# EAGLE schematic receiver (EAGLE 5.09)
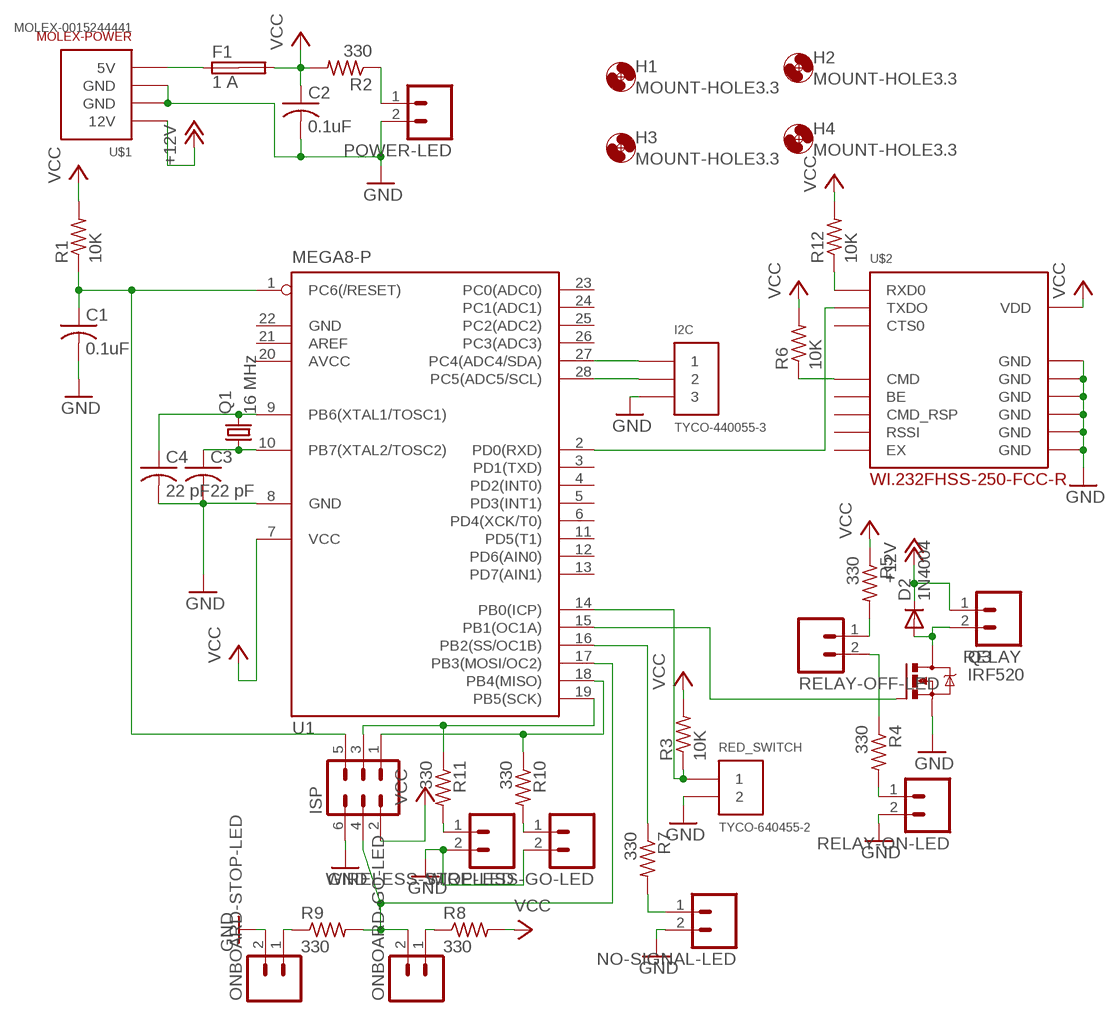
[diagram p0: schematic, sheet 1]

## Parts
C1  0.1uF  C-USC1206  [C1206]
C2  0.1uF  C-USC1206  [C1206]
C3  22 pF  C-USC1206  [C1206]
C4  22 pF  C-USC1206  [C1206]
D2  1N4004  [DO41-10]
F1  1 A  SHK20Q  [SHK20Q]
H1  MOUNT-HOLE3.3  [3,3]
H2  MOUNT-HOLE3.3  [3,3]
H3  MOUNT-HOLE3.3  [3,3]
H4  MOUNT-HOLE3.3  [3,3]
I2C  TYCO-440055-3  [HEADER-RA-2.00MM-3]
ISP  MA03-2  [MA03-2]
NO-SIGNAL-LED  M02POLAR  [MOLEX-1X2]
ONBOARD-GO-LED  M02POLAR  [MOLEX-1X2]
ONBOARD-STOP-LED  M02POLAR  [MOLEX-1X2]
POWER-LED  M02POLAR  [MOLEX-1X2]
Q1  16 MHz  CRYSTALHC49S  [HC49/S]
Q3  IRF520  [TO220BV]
R1  10K  R-US_R1206  [R1206]
R2  330  R-US_R1206  [R1206]
R3  10K  R-US_R1206  [R1206]
R4  330  R-US_R1206  [R1206]
R5  330  R-US_R1206  [R1206]
R6  10K  R-US_R1206  [R1206]
R7  330  R-US_R1206  [R1206]
R8  330  R-US_R1206  [R1206]
R9  330  R-US_R1206  [R1206]
R10  330  R-US_R1206  [R1206]
R11  330  R-US_R1206  [R1206]
R12  10K  R-US_R1206  [R1206]
RED_SWITCH  TYCO-640455-2  [HEADER-RA-POL-.100IN-2]
RELAY  M02POLAR  [MOLEX-1X2]
RELAY-OFF-LED  M02POLAR  [MOLEX-1X2]
RELAY-ON-LED  M02POLAR  [MOLEX-1X2]
U1  MEGA8-P  [DIL28-3]
U$1  MOLEX-0015244441  [MOLEX-0015244441B]
U$2  WI.232FHSS-250-FCC-R  [RADIOTRONIX-EVM]
WIRELESS-GO-LED  M02POLAR  [MOLEX-1X2]
WIRELESS-STOP-LED  M02POLAR  [MOLEX-1X2]

## Nets
+12V: D2.C RELAY.1 U$1.1(12V)
GND: C1.2 C2.2 C3.2 C4.2 I2C.3 ISP.6 NO-SIGNAL-LED.2 ONBOARD-STOP-LED.2 POWER-LED.2 Q3.S RED_SWITCH.2 RELAY-ON-LED.2 U1.8(GND) U$1.2(GND) U$1.3(GND) U$2.JP1-1(GND) U$2.JP1-2(GND) U$2.JP1-11(GND) U$2.JP1-12(GND) U$2.JP2-11(GND) U$2.JP2-12(GND) WIRELESS-GO-LED.2 WIRELESS-STOP-LED.2
N$1: D2.A Q3.D RELAY.2
N$2: C3.1 Q1.1 U1.10(PB7(XTAL2/TOSC2))
N$3: C1.1 ISP.5 R1.1 U1.1(PC6(/RESET))
N$4: C4.1 Q1.2 U1.9(PB6(XTAL1/TOSC1))
N$5: Q3.G U1.15(PB1(OC1A))
N$6: F1.1A U$1.4(5V)
N$7: R3.1 RED_SWITCH.1 U1.14(PB0(ICP))
N$8: R5.2 RELAY-OFF-LED.1
N$9: R4.1 RELAY-OFF-LED.2
N$10: R4.2 RELAY-ON-LED.1
N$11: NO-SIGNAL-LED.1 R7.2
N$12: R6.1 U$2.JP2-5(CMD)
N$13: I2C.1 U1.27(PC4(ADC4/SDA))
N$14: I2C.2 U1.28(PC5(ADC5/SCL))
N$15: U1.2(PD0(RXD)) U$2.JP2-3(TXDO)
N$16: R7.1 U1.16(PB2(SS/OC1B))
N$17: ONBOARD-STOP-LED.1 R9.1
N$18: ONBOARD-GO-LED.1 R8.1
N$19: R10.2 WIRELESS-GO-LED.1
N$20: R11.2 WIRELESS-STOP-LED.1
N$21: R12.1 U$2.JP2-2(RXD0)
N$22: ISP.1 R10.1 U1.18(PB4(MISO))
N$28: POWER-LED.1 R2.1
N$31: ISP.3 R11.1 U1.19(PB5(SCK))
N$33: ISP.4 ONBOARD-GO-LED.2 R9.2 U1.17(PB3(MOSI/OC2))
VCC: C2.1 F1.2A ISP.2 R1.2 R2.2 R3.2 R5.1 R6.2 R8.2 R12.2 U1.7(VCC) U$2.JP2-1(VDD)
Unconnected: F1.1B F1.2B U1.3(PD1(TXD)) U1.4(PD2(INT0)) U1.5(PD3(INT1)) U1.6(PD4(XCK/T0)) U1.11(PD5(T1)) U1.12(PD6(AIN0)) U1.13(PD7(AIN1)) U1.21(AREF) U1.23(PC0(ADC0)) U1.24(PC1(ADC1)) U1.25(PC2(ADC2)) U1.26(PC3(ADC3)) U$2.JP1-3(BE) U$2.JP1-4(CMD_RSP) U$2.JP1-5(RSSI) U$2.JP1-6(EX) U$2.JP2-4(CTS0)

## Power pins joined to a net without a drawn wire
AVCC: U1.20(AVCC)
GND: U1.22(GND)

## Library data of the parts
C1-C4 = rcl:C-US: CAPACITOR, American symbol
D2 = diode:1N4004: DIODE general purpose rectifier, 1 A
F1 = fuse:SHK20Q: FUSE HOLDER 5 x 20 mm, SH contact, E1207 Buerklin 64G6061
H1-H4 = holes:MOUNT-HOLE: MOUNTING HOLE with drill center marker
I2C = chicagoedt:TYCO-440055-3: 3 pin right angle header with shroud and 2.00 mm pitch.
ISP = con-lstb:MA03-2: PIN HEADER
NO-SIGNAL-LED ONBOARD-GO-LED ONBOARD-STOP-LED POWER-LED RELAY RELAY-OFF-LED RELAY-ON-LED WIRELESS-GO-LED WIRELESS-STOP-LED = SparkFun:M02: Header 2 Standard 2-pin 0.1" header. Use with straight break away headers (SKU : PRT-00116), right angle break away headers (PRT-00553), swiss pins (PRT-00743), machine pins (PRT-00117), and female headers (PRT-00115). Molex polarized connector foot print use with SKU : PRT-08233 with associated crimp pins and housings.
Q1 = crystal:CRYSTAL: CRYSTAL
Q3 = transistor-power:IRF520: HEXFET Power MOSFET
R1-R12 = resistor:R-US_: RESISTOR, American symbol
RED_SWITCH = chicagoedt:TYCO-640455-2: 2 pin right angle header with polarizing tab and .100" pitch.
U1 = atmel:MEGA8-P: MICROCONTROLLER 8 Kbytes FLASH, 1 kbytes SRAM, 512 bytes EEPROM, USART, 4-channel 10 bit ADC, 2-channel 8 bit ADC Pin compatible with Atmega48, ATMega88, ATMega168 Source: avr.lbr
U$1 = chicagoedt:MOLEX-0015244441: 5.08mm (.200") Pitch Disk Drive Power Connection System Header, Right Angle, Through Hole, 4 Circuits, Lead-free, 3.56mm (.140") PC Tail Length, with PCB Locator Peg
U$2 = chicagoedt:WI.232FHSS-250-FCC-R: 902 - 928 MHz FCC approved Wi.232FHSS-250-R modules with reverse SMA connector